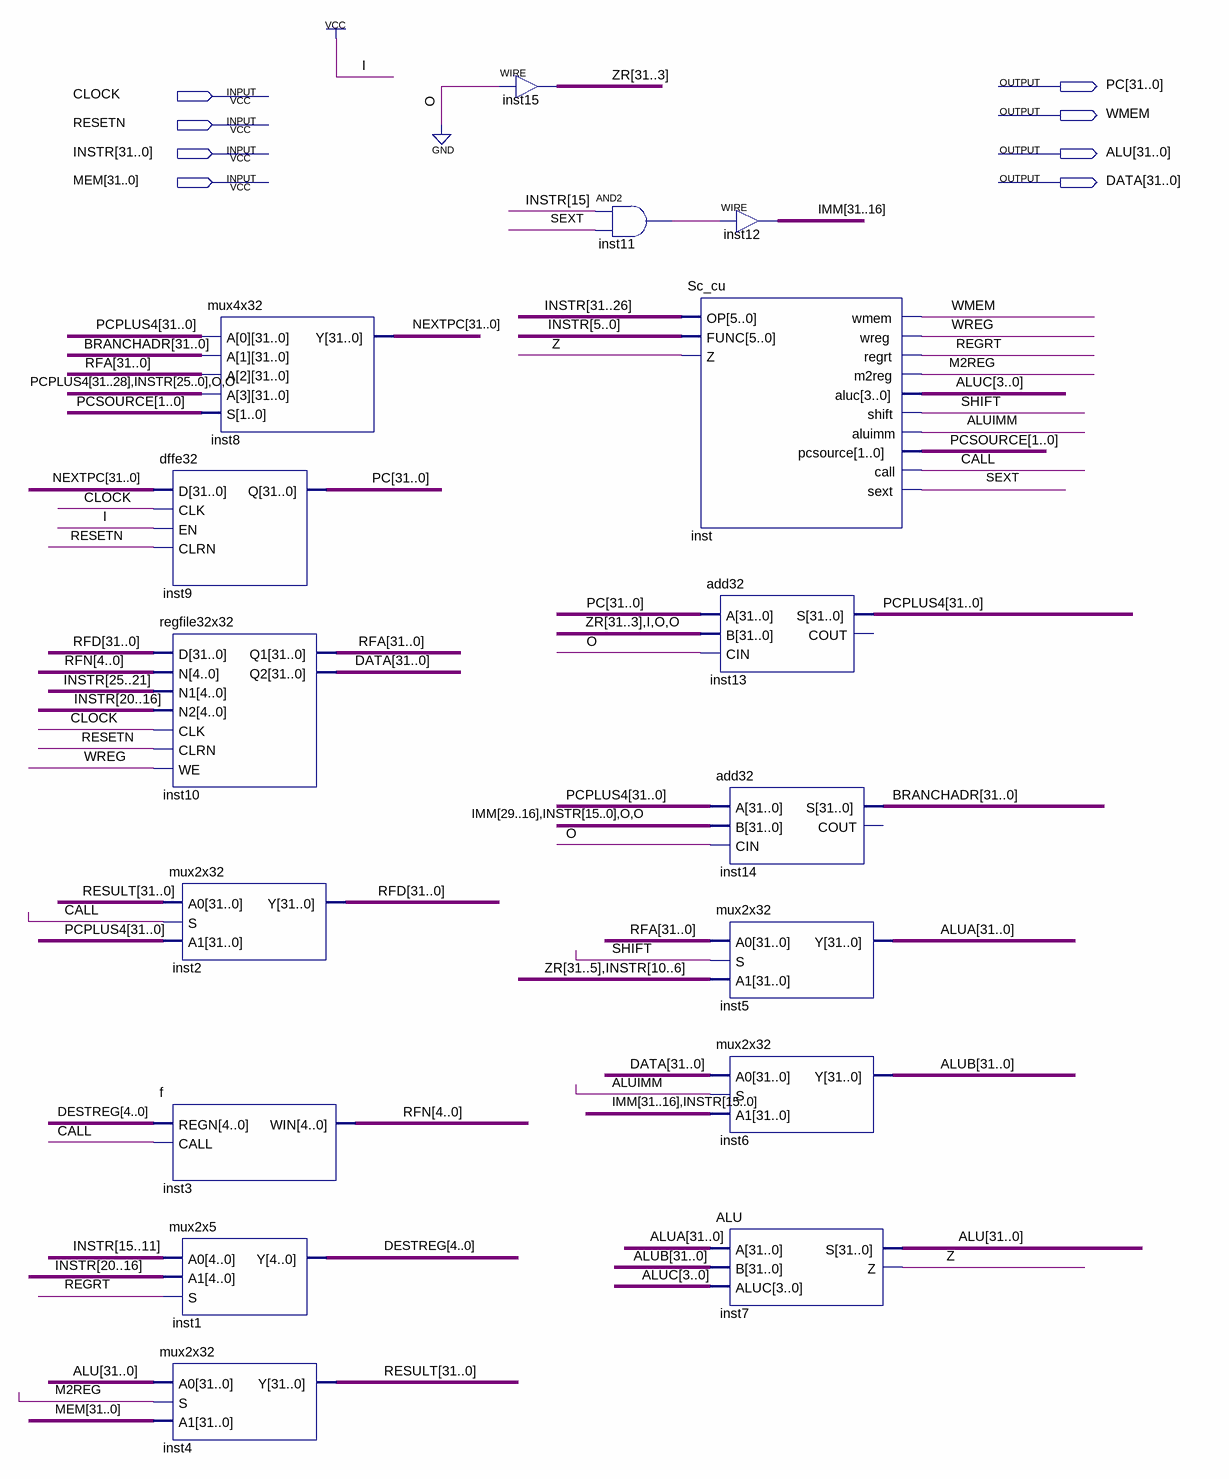
[diagram p0: schematic sheet]
// Quartus schematic sc_cpu.bdf as structural Verilog: 16 symbols, 8 pins
module sc_cpu (
  input  CLOCK,
  input  RESETN,
  input  [31:0] INSTR,
  input  [31:0] MEM,
  output [31:0] PC,
  output WMEM,
  output [31:0] ALU,
  output [31:0] DATA
);

  wire ALUIMM, CALL, inst11_out, M2REG, REGRT, SEXT, SHIFT, WREG, Z;
  wire [1:0] PCSOURCE;
  wire [3:0] ALUC;
  wire [4:0] DESTREG, RFN;
  wire [31:0] ALUA, ALUB, BRANCHADR, NEXTPC, PCPLUS4, RESULT, RFA, RFD;
  wire [31:3] ZR;
  wire [31:16] IMM;

  dffe32 inst9 (.D(NEXTPC), .CLK(CLOCK), .EN(1'b1), .CLRN(RESETN), .Q(PC));
  regfile32x32 inst10 (
    .D(RFD), .N(RFN), .N1(INSTR[25:21]), .N2(INSTR[20:16]), .CLK(CLOCK), .CLRN(RESETN), .WE(WREG), .Q1(RFA),
    .Q2(DATA));
  mux2x32 inst2 (.A0(RESULT), .S(CALL), .A1(PCPLUS4), .Y(RFD));
  f inst3 (.REGN(DESTREG), .CALL(CALL), .WIN(RFN));
  mux2x5 inst1 (.A0(INSTR[15:11]), .A1(INSTR[20:16]), .S(REGRT), .Y(DESTREG));
  mux2x32 inst4 (.A0(ALU), .S(M2REG), .A1(MEM), .Y(RESULT));
  mux4x32 inst8 (
    .A_0(PCPLUS4), .A_1(BRANCHADR), .A_2(RFA), .A_3({PCPLUS4[31:28], INSTR[25:0], 2'b00}), .S(PCSOURCE),
    .Y(NEXTPC));
  assign ZR = {29{1'b0}};  // WIRE inst15
  and inst11 (inst11_out, INSTR[15], SEXT);
  Sc_cu inst (
    .OP(INSTR[31:26]), .FUNC(INSTR[5:0]), .Z(Z), .wmem(WMEM), .wreg(WREG), .regrt(REGRT), .m2reg(M2REG),
    .aluc(ALUC), .shift(SHIFT), .aluimm(ALUIMM), .pcsource(PCSOURCE), .call(CALL), .sext(SEXT));
  add32 inst13 (.A(PC), .B({ZR, 3'b100}), .CIN(1'b0), .S(PCPLUS4));  // open: COUT
  assign IMM = {16{inst11_out}};  // WIRE inst12
  add32 inst14 (.A(PCPLUS4), .B({IMM[29:16], INSTR[15:0], 2'b00}), .CIN(1'b0), .S(BRANCHADR));  // open: COUT
  mux2x32 inst5 (.A0(RFA), .S(SHIFT), .A1({ZR[31:5], INSTR[10:6]}), .Y(ALUA));
  mux2x32 inst6 (.A0(DATA), .S(ALUIMM), .A1({IMM, INSTR[15:0]}), .Y(ALUB));
  ALU inst7 (.A(ALUA), .B(ALUB), .ALUC(ALUC), .S(ALU), .Z(Z));
endmodule
